# EAGLE design optical1 (EAGLE 8.3.1)
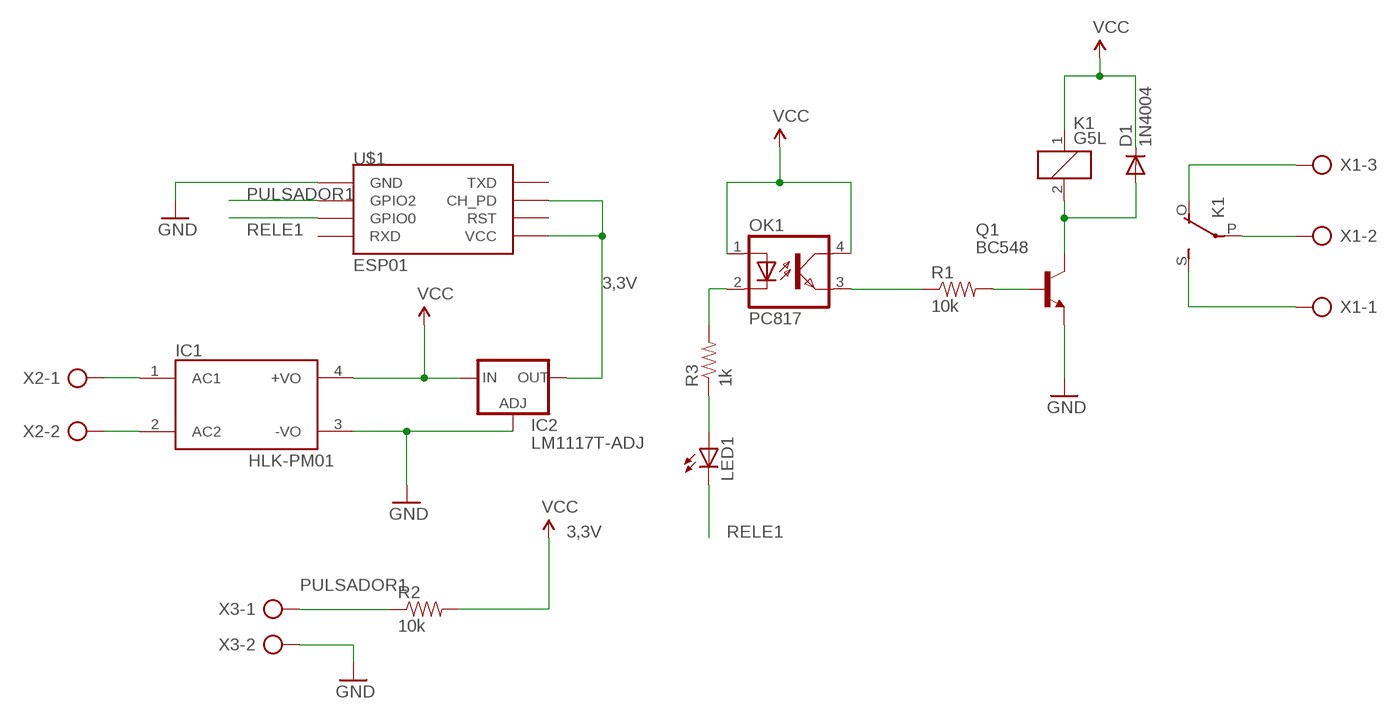
[diagram p0: schematic, sheet 1]

## Parts
D1  1N4004  [DO41-10]
IC1  HLK-PM01  [HLK-PM**]
IC2  LM1117T-ADJ  [TO220]
K1  G5L  [G5LE]
LED1  LED5MM  [LED5MM]
OK1  PC817  [DIL04]
Q1  BC548  [TO92-EBC]
R1  10k  10KOHM-1/4W5%(PTH)  [AXIAL-0.3]
R2  10k  10KOHM-1/4W5%(PTH)  [AXIAL-0.3]
R3  1k  10KOHM-1/4W5%(PTH)  [AXIAL-0.3]
U$1  ESP01  [ESP01]
X1  AK500/3-H  [AK500/3-H]
X2  AK500/2-H  [AK500/2-H]
X3  AK500/2-H  [AK500/2-H]

## Nets
3,3V: IC2.2(OUT) R2.P$2 U$1.CH_PD U$1.VCC ; supply symbol labelled VCC
GND: IC1.3(-VO) IC2.1(ADJ) Q1.E U$1.GND X3.2
N$1: D1.A K1.2 Q1.C
N$2: K1.P(2:P) X1.2
N$3: K1.S(2:S) X1.1
N$4: K1.O(2:O) X1.3
N$5: OK1.3(EMIT) R1.P$1
N$6: Q1.B R1.P$2
N$7: IC1.1(AC1) X2.1
N$8: IC1.2(AC2) X2.2
N$9: OK1.2(C) R3.P$2
N$10: LED1.A R3.P$1
PULSADOR1: R2.P$1 U$1.GPIO2 X3.1
RELE1: LED1.K(C) U$1.GPIO0
VCC: D1.C IC1.4(+VO) IC2.3(IN) K1.1 OK1.1(A) OK1.4(COL)
Unconnected: U$1.RST U$1.RX(RXD) U$1.TX(TXD)

## Library data of the parts
D1 = diode:1N4004: DIODE general purpose rectifier, 1 A
IC1 = hi-link_hlk:HLK-PM01: Przetwornica Hi-Link 5V Model: HLK-PM01 INPUT: 100-240V AC OUTPUT: 5V DC, 0.6A - 3W
IC2 = lm1117:LM1117T-ADJ
K1 = relay:G5L: RELAY 1 x switch, 10 A/120 V AC, 8 A/30 V ADC, Omron; OC_FARNELL: unknown; OC_NEWARK: unknown
LED1 = led:LED: LED OSRAM: - CHIPLED LG R971, LG N971, LY N971, LG Q971, LY Q971, LO R971, LY R971 LH N974, LH R974 LS Q976, LO Q976, LY Q976 LO Q996 - Hyper CHIPLED LW Q18S LB Q993, LB Q99A, LB R99A - SideLED LS A670, LO A670, LY A670, LG A670, LP A670 LB A673, LV A673, LT A673, LW A673 LH A674 LY A675 LS A676, LA A676, LO A676, LY A676, LW A676 LS A679, LY A679, LG A679 - Hyper Micro SIDELED® LS Y876, LA Y876, LO Y876, LY Y876 LT Y87S - SmartLED LW L88C, LW L88S LB L89C, LB L89S, LG L890 LS L89K, LO L89K, LY L89K LS L896, LA L896, LO L896, LY L896 - TOPLED LS T670, LO T670, LY T670, LG T670, LP T670 LSG T670, LSP T670, LSY T670, LOP T670, LYG T670 LG T671, LOG T671, LSG T671 LB T673, LV T673, LT T673, LW T673 LH T674 LS T676, LA T676, LO T676, LY T676, LB T676, LH T676, LSB T676, LW T676 LB T67C, LV T67C, LT T67C, LS T67K, LO T67K, LY T67K, LW E67C LS E67B, LA E67B, LO E67B, LY E67B, LB E67C, LV E67C, LT E67C LW T67C LS T679, LY T679, LG T679 LS T770, LO T770, LY T770, LG T770, LP T770 LB T773, LV T773, LT T773, LW T773 LH T774 LS E675, LA E675, LY E675, LS T675 LS T776, LA T776, LO T776, LY T776, LB T776 LHGB T686 LT T68C, LB T68C - Hyper Mini TOPLED® LB M676 - Mini TOPLED Santana® LG M470 LS M47K, LO M47K, LY M47K Source: http://www.osram.convergy.de LUXEON: - LUMILED® LXK2-PW12-R00, LXK2-PW12-S00, LXK2-PW14-U00, LXK2-PW14-V00 LXK2-PM12-R00, LXK2-PM12-S00, LXK2-PM14-U00 LXK2-PE12-Q00, LXK2-PE12-R00, LXK2-PE12-S00, LXK2-PE14-T00, LXK2-PE14-U00 LXK2-PB12-K00, LXK2-PB12-L00, LXK2-PB12-M00, LXK2-PB14-N00, LXK2-PB14-P00, LXK2-PB14-Q00 LXK2-PR12-L00, LXK2-PR12-M00, LXK2-PR14-Q00, LXK2-PR14-R00 LXK2-PD12-Q00, LXK2-PD12-R00, LXK2-PD12-S00 LXK2-PH12-R00, LXK2-PH12-S00 LXK2-PL12-P00, LXK2-PL12-Q00, LXK2-PL12-R00 Source: www.luxeon.com KINGBRIGHT: KA-3528ASYC Source: www.kingbright.com
OK1 = optocoupler:PC817: SHARP OPTO COUPLER; MPN: PC817X4J000F; OC_FARNELL: 9707727; OC_NEWARK: 97K7059
Q1 = transistor-npn:BC548*: NPN Transistor
R1 R2 = SparkFun-Resistors:10KOHM-1/4W5%(PTH): RES-09435; PROD_ID: RES-9435
R3 = SparkFun-Resistors:10KOHM-1/4W5%(PTH): RES-09435; PROD_ID: RES-9435; VALUE: 10k
U$1 = esp8266modules:ESP01: ESP8266 Wifi module 01
X1 = con-ptr500:AK500/3-H: CONNECTOR Aug. 2004 / PTR Meßtechnik: Die Bezeichnung der Serie AK505 wurde geändert. Es handelt sich hierbei um AK500 in horizontaler Ausführung.; OC_FARNELL: unknown; OC_NEWARK: unknown
X2 X3 = con-ptr500:AK500/2-H: CONNECTOR Aug. 2004 / PTR Meßtechnik: Die Bezeichnung der Serie AK505 wurde geändert. Es handelt sich hierbei um AK500 in horizontaler Ausführung.; OC_FARNELL: unknown; OC_NEWARK: unknown

## Board
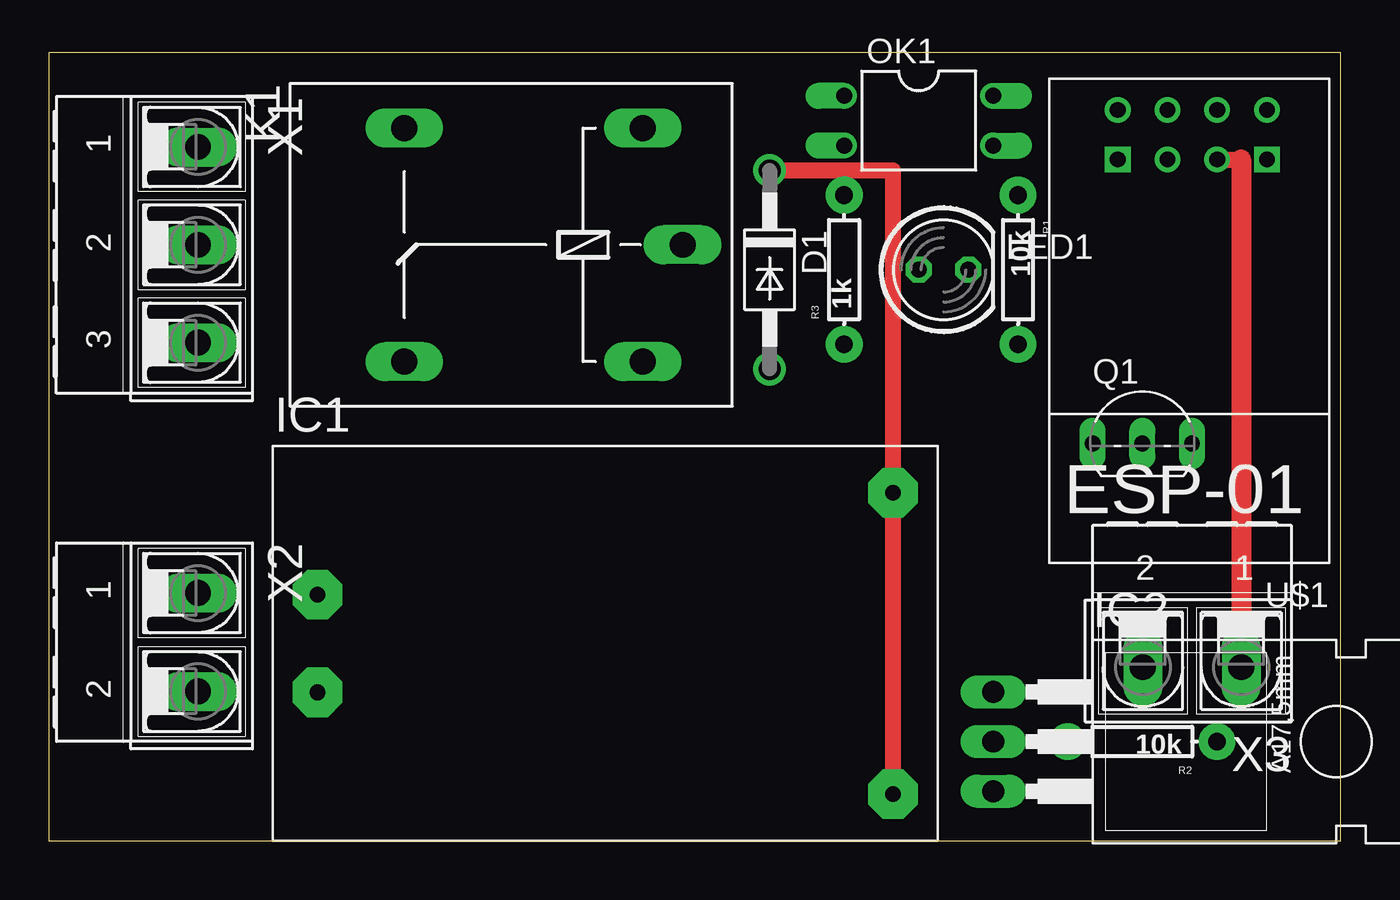
[diagram p1: board, top side]
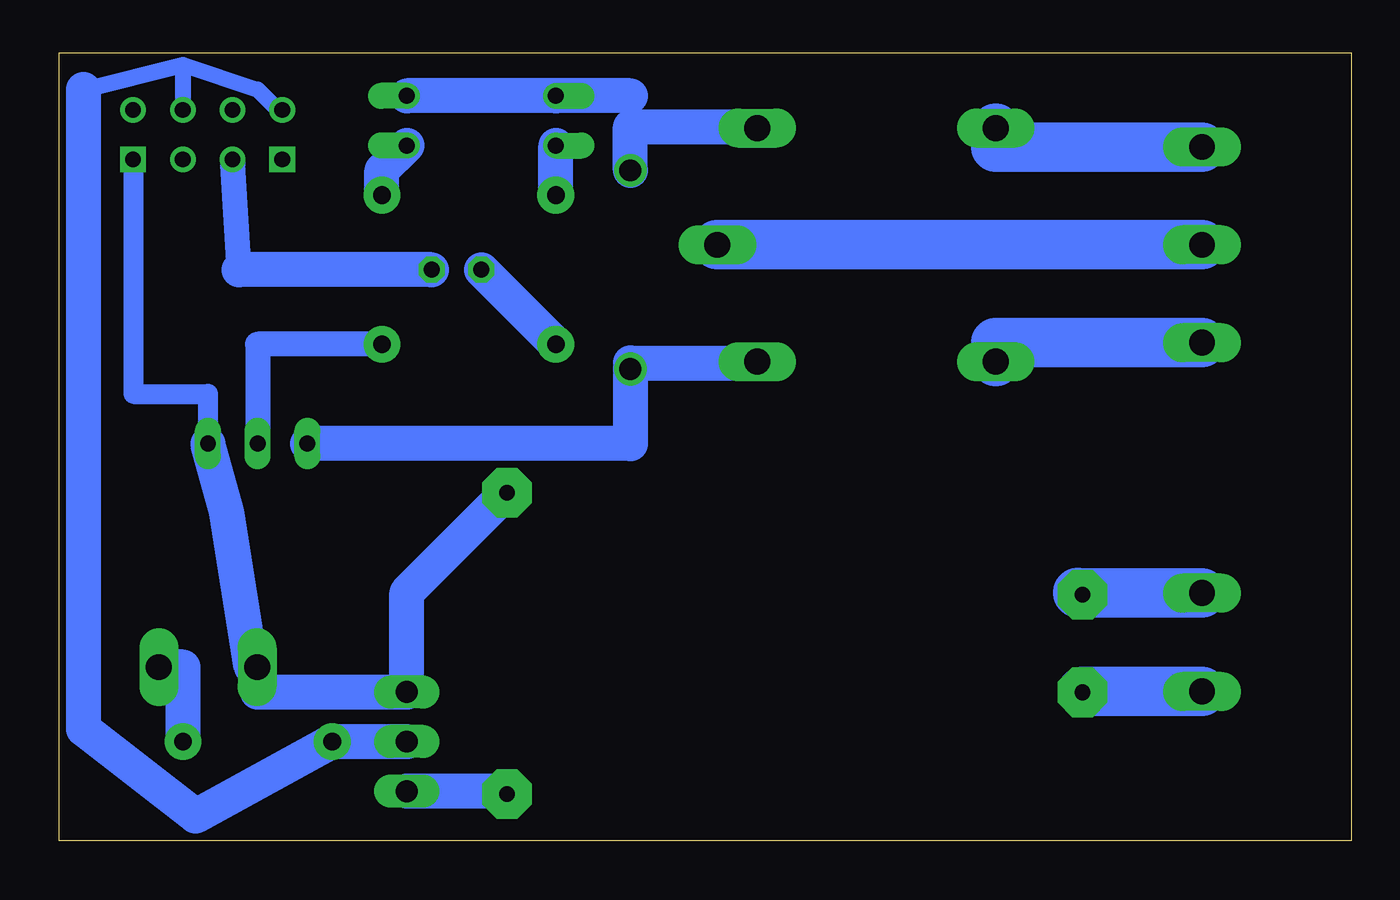
[diagram p2: board, bottom side, seen from below]

Size 66.02 x 40.31 mm. Coordinates in mm from the lower left corner, seen from the top.
Outline: 0,0 66.02,0 66.02,40.31 0,40.31 0,0
Copper layers (1*16): Top 0.035mm / dielectric 1.5mm / Bottom 0.035mm
Design rules "default": minimum track width 10mil, minimum drill 24mil, track to track 8mil, track to pad 8mil, pad to pad 8mil, via to via 8mil, smd to smd 8mil, copper to edge 40mil, drill to drill 8mil, minimum pad ring 10mil, minimum via ring 8mil, stop-mask expansion 4mil, vias tented up to drill 0mil, thermal gap 10mil

### Footprints (pad centres in the part's own frame; a part is rotated, then mirrored left to right if it is on the bottom)
DO41-10 = drill 1.118: A 5.08,0; C -5.08,0
HLK-PM** = drill 0.8 pad 2.54 octagon: 1 -14.21,2.44; 2 -14.21,-2.56; 3 15.19,7.64; 4 15.19,-7.76
TO220 = drill 1.118 long: 1 -2.54,-6.35; 2 0,-6.35; 3 2.54,-6.35
G5LE = drill 1.321 long: 1 -7.493,-5.969; 2 -7.493,5.969; O 4.699,5.969; P -9.525,0; S 4.699,-5.969
LED5MM = drill 0.813 octagon: A -1.27,0; K 1.27,0
DIL04 = drill 0.813 offset: 1 -1.27,-3.81; 2 1.27,-3.81; 3 1.27,3.81; 4 -1.27,3.81
TO92-EBC = drill 0.813 long: B 0,-1.27; C -2.54,-1.27; E 2.54,-1.27
AXIAL-0.3 = drill 0.9 pad 1.88: P$1 -3.81,0; P$2 3.81,0
ESP01 = drill 0.8: CH_PD -1.285,-8.178; GPIO0 1.255,-5.638; GPIO2 -1.285,-5.638; RST 1.255,-8.178; TX -3.825,-8.178; VCC 3.795,-8.178 | drill 0.8 square: GND -3.825,-5.638; RX 3.795,-5.638
AK500/3-H = drill 1.321 long: 1 -5.004,0; 2 0,0; 3 5.004,0
AK500/2-H = drill 1.321 long: 1 -2.515,0; 2 2.515,0

### Placement (x,y rotation side)
D1  36.83,29.21 270 top
IC1  27.94,10.16 0 top
IC2  54.61,5.08 270 top
K1  22.86,30.48 180 top
LED1  45.72,29.21 0 top
OK1  44.45,36.83 270 top
Q1  55.88,21.59 0 top
R1  49.53,29.21 270 top
R2  55.88,5.08 180 top
R3  40.64,29.21 90 top
U$1  58.42,29.21 180 top
X1  7.62,30.48 270 top
X2  7.62,10.16 270 top
X3  58.42,8.89 180 top

### Tracks (layer width: path | path; a pad name or v marks a point on that pad's centre or on a via)
3,3V
  Bottom 0.254: 54.93,37.47 U$1.VCC | 59.69,37.47 U$1.CH_PD
  Bottom 0.813: 54.93,37.47 55.88,38.42 59.69,39.69 | 59.69,37.47 59.69,39.69 | 64.77,38.42 59.69,39.69
  Bottom 1.778: IC2.2 R2.P$2 59.05,1.27 64.77,5.71 64.77,38.42
GND
  Bottom 0.254: 62.23,34.92 U$1.GND | 55.88,7.62 55.88,8.89 X3.2 56.2,8.89 | 43.18,17.78 IC1.3
  Bottom 1.016: 62.23,34.92 62.23,22.86 58.42,22.86 Q1.E
  Bottom 1.778: 55.88,7.62 IC2.1 48.26,12.7 43.18,17.78 | Q1.E 57.47,16.83 56.2,8.89
N$1
  Bottom 0.254: D1.A 36.83,24.45 | 30.48,24.45 K1.2
  Bottom 1.778: Q1.C 36.83,20.32 D1.A | 36.83,24.45 30.48,24.45
N$2
  Bottom 2.54: X1.2 K1.P
N$3
  Bottom 2.54: X1.1 18.16,35.48 K1.S
N$4
  Bottom 2.54: X1.3 18.16,25.48 K1.O
N$5
  Bottom 1.778: OK1.3 49.53,34.29 R1.P$1
N$6
  Bottom 1.27: Q1.B 55.88,25.4 R1.P$2
N$7
  Bottom 0.254: 13.97,12.7 IC1.1
  Bottom 2.54: X2.1 13.97,12.68 13.97,12.7
N$8
  Bottom 2.54: X2.2 13.73,7.64 IC1.2
N$9
  Bottom 1.778: R3.P$2 OK1.2
N$10
  Bottom 1.778: R3.P$1 LED1.A
PULSADOR1
  Top 0.813: U$1.GPIO2 60.94,34.85
  Top 1.016: 60.94,34.85 X3.1
  Bottom 1.778: R2.P$1 59.69,8.89 X3.1
RELE1
  Bottom 0.254: 57.15,34.61 U$1.GPIO0
  Bottom 1.27: 56.83,29.21 57.15,34.61
  Bottom 1.778: LED1.K 56.83,29.21
VCC
  Top 0.813: D1.C 43.13,34.29 IC1.4
  Bottom 0.254: 43.18,2.54 IC1.4 42.86,2.54 | 36.83,36.51 36.83,38.1 | 30.48,36.51 K1.1
  Bottom 1.778: 43.18,2.54 IC2.3 | 36.83,38.1 OK1.1 OK1.4 | D1.C 36.83,36.51 30.48,36.51